# EAGLE design MIDI_CV_CONV (EAGLE 9.0.1)
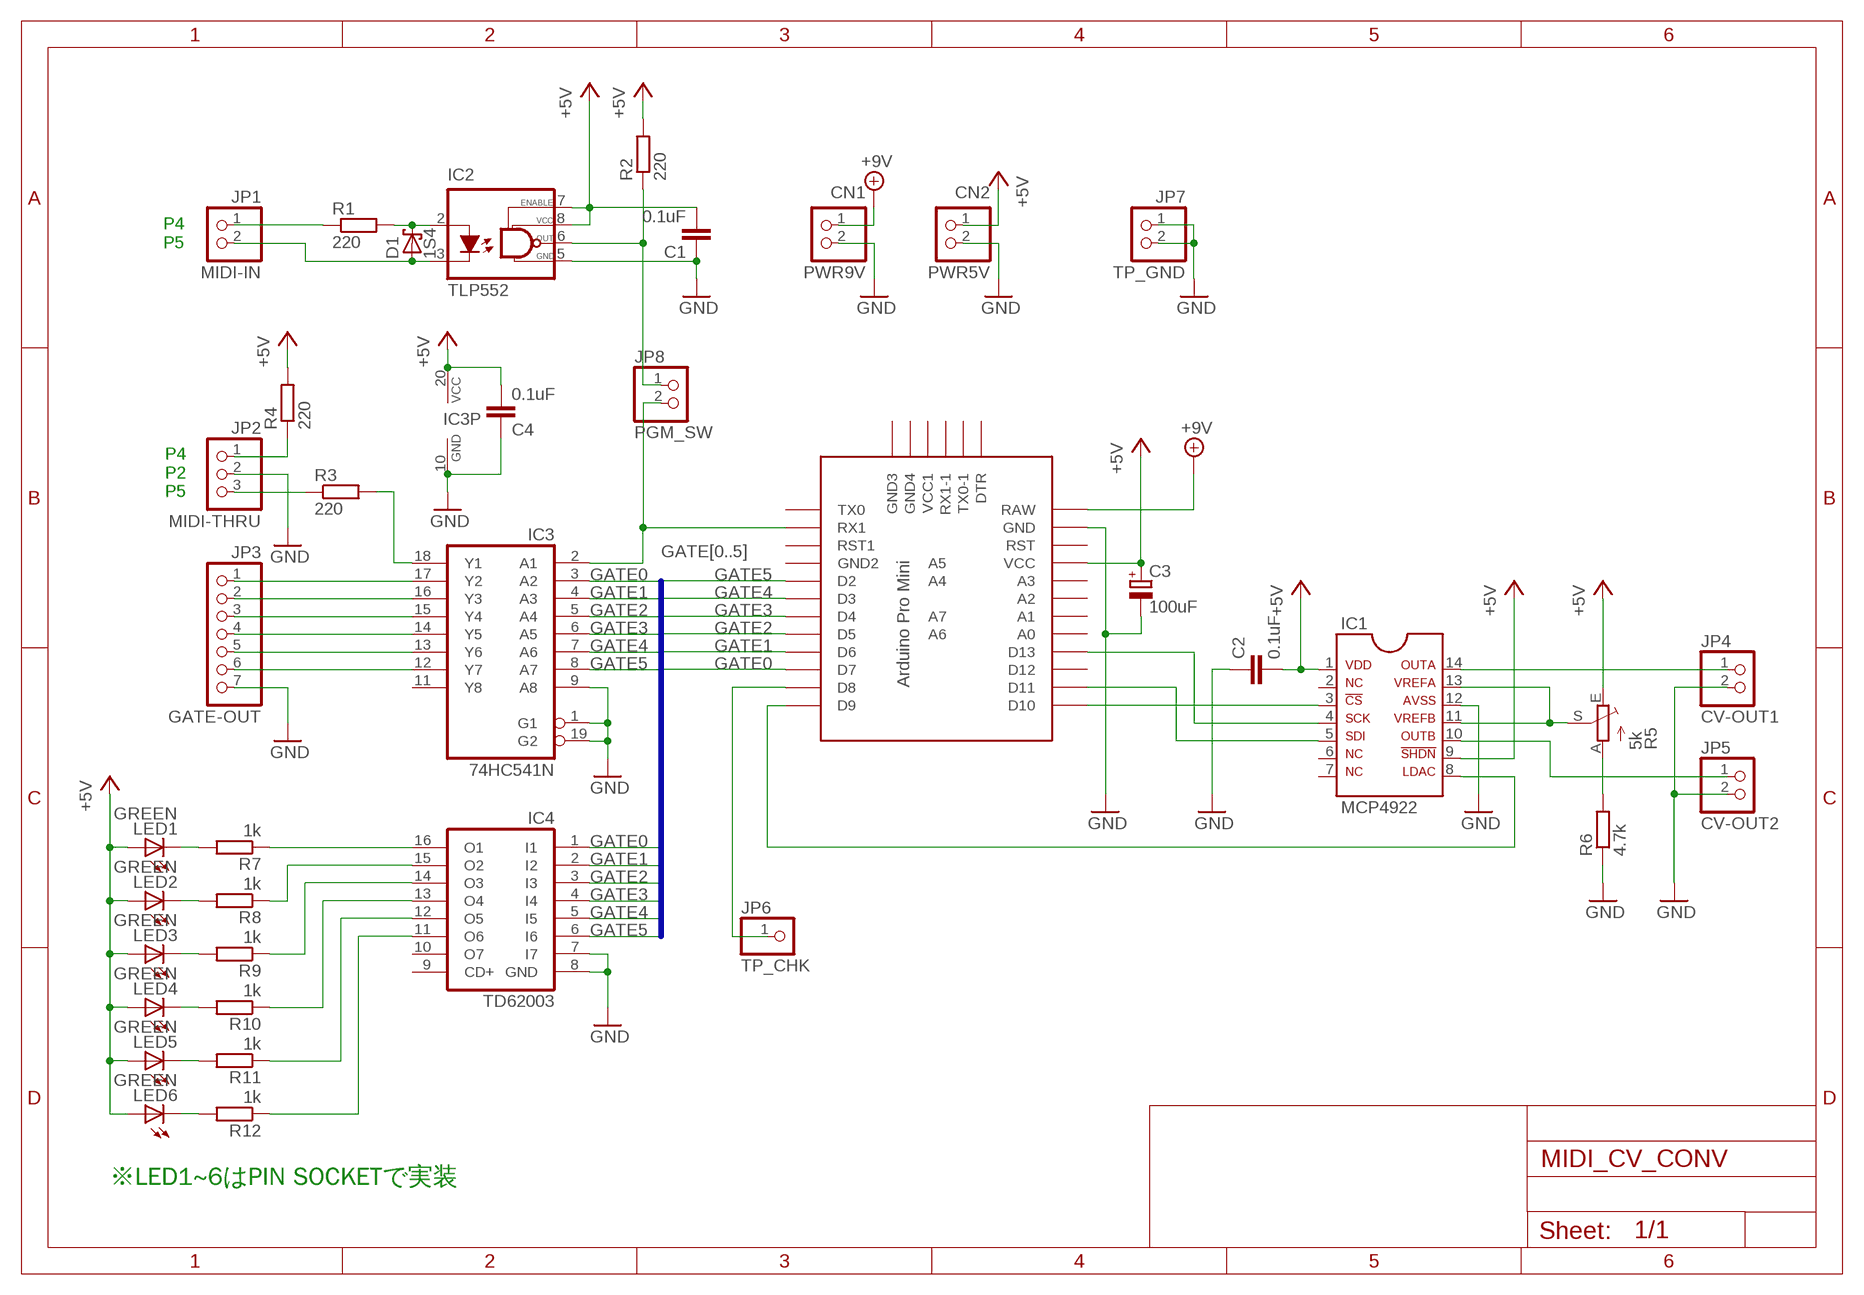
[diagram p0: schematic, sheet 1]

## Parts
C1  0.1uF  C-EU025-024X044  [C025-024X044]
C2  0.1uF  C-EU050-024X044  [C050-024X044]
C3  100uF  CPOL-EUE2.5-7  [E2,5-7]
C4  0.1uF  C-EU025-024X044  [C025-024X044]
CN1  PWR9V  B2B-XH-A  [B2B-XH-A]
CN2  PWR5V  B2B-XH-A  [B2B-XH-A]
D1  1S4  SCHOTTKY-DIODEDO35-7  [DO35-7]
IC1  MCP4922  [MCP4922]
IC2  TLP552  [DIL8]
IC3  74HC541N  [DIL20]
IC4  TD62003  ULN2001AN  [DIL16]
JP1  MIDI-IN  PINHD-1X2  [1X02]
JP2  MIDI-THRU  PINHD-1X3  [1X03]
JP3  GATE-OUT  PINHD-1X7  [1X07]
JP4  CV-OUT1  PINHD-1X2  [1X02]
JP5  CV-OUT2  PINHD-1X2  [1X02]
JP6  TP_CHK  PINHD-1X1  [1X01]
JP7  TP_GND  PINHD-1X2  [1X02]
JP8  PGM_SW  PINHD-1X2  [1X02]
LED1  GREEN  LED3MM  [LED3MM]
LED2  GREEN  LED3MM  [LED3MM]
LED3  GREEN  LED3MM  [LED3MM]
LED4  GREEN  LED3MM  [LED3MM]
LED5  GREEN  LED3MM  [LED3MM]
LED6  GREEN  LED3MM  [LED3MM]
R1  220  R-EU_0207/7  [0207/7]
R2  220  R-EU_0207/7  [0207/7]
R3  220  R-EU_0207/7  [0207/7]
R4  220  R-EU_0207/7  [0207/7]
R5  5k  TRIM_EU-CT6  [CT6]
R6  4.7k  R-EU_0207/7  [0207/7]
R7  1k  R-EU_0207/2V  [0207/2V]
R8  1k  R-EU_0207/2V  [0207/2V]
R9  1k  R-EU_0207/2V  [0207/2V]
R10  1k  R-EU_0207/2V  [0207/2V]
R11  1k  R-EU_0207/2V  [0207/2V]
R12  1k  R-EU_0207/2V  [0207/2V]
U$1  PRO-MINI-2 (16MHz/5V)  PRO-MINI-2  [PRO-MINI-2]

## Nets
+5V: C1.2 C2.2 C3.+ C4.2 CN2.1 IC1.1 IC1.9 IC2.7(EN) IC2.8(VCC) IC3.20(VCC) LED1.A LED2.A LED3.A LED4.A LED5.A LED6.A R2.2 R4.2 R5.E U$1.VCC
+9V: CN1.1 U$1.RAW
GATE0: IC3.3(A2) IC4.1(I1) U$1.D7
GATE1: IC3.4(A3) IC4.2(I2) U$1.D6
GATE2: IC3.5(A4) IC4.3(I3) U$1.D5
GATE3: IC3.6(A5) IC4.4(I4) U$1.D4
GATE4: IC3.7(A6) IC4.5(I5) U$1.D3
GATE5: IC3.8(A7) IC4.6(I6) U$1.D2
GND: C1.1 C2.1 C3.- C4.1 CN1.2 CN2.2 IC1.12 IC2.5(GND) IC3.1(G1) IC3.9(A8) IC3.10(GND) IC3.19(G2) IC4.7(I7) IC4.8(GND) JP2.2 JP3.7 JP4.2 JP5.2 JP7.1 JP7.2 R6.1 U$1.GND
N$1: D1.A IC2.3(C) JP1.2
N$2: IC3.2(A1) JP8.2 U$1.RX1
N$3: IC2.6(OUT) JP8.1 R2.1
N$4: D1.C IC2.2(A) R1.2
N$5: JP2.1 R4.1
N$6: JP2.3 R3.1
N$7: IC3.18(Y1) R3.2
N$8: IC3.17(Y2) JP3.1
N$9: IC3.16(Y3) JP3.2
N$10: IC3.15(Y4) JP3.3
N$11: IC3.14(Y5) JP3.4
N$12: IC3.13(Y6) JP3.5
N$13: IC3.12(Y7) JP3.6
N$14: IC1.3 U$1.D10
N$15: JP6.1 U$1.D8
N$16: LED1.K(C) R7.2
N$17: LED2.K(C) R8.2
N$18: LED3.K(C) R9.2
N$19: LED4.K(C) R10.2
N$20: LED5.K(C) R11.2
N$21: IC1.4 U$1.D13
N$22: IC1.5 U$1.D11
N$23: IC1.8 U$1.D9
N$24: R5.A R6.2
N$25: IC1.14 JP4.1
N$26: IC1.11 IC1.13 R5.S
N$27: IC1.10 JP5.1
N$28: LED6.K(C) R12.2
N$29: JP1.1 R1.1
N$30: IC4.16(O1) R7.1
N$37: IC4.15(O2) R8.1
N$38: IC4.14(O3) R9.1
N$39: IC4.13(O4) R10.1
N$40: IC4.12(O5) R11.1
N$41: IC4.11(O6) R12.1
Unconnected: IC1.2 IC1.6 IC1.7 IC3.11(Y8) IC4.9(CD+) IC4.10(O7) U$1.A0 U$1.A1 U$1.A2 U$1.A3 U$1.A4 U$1.A5 U$1.A6 U$1.A7 U$1.D12 U$1.DTR U$1.GND1(GND2) U$1.GND2(GND3) U$1.GND3(GND4) U$1.RST U$1.RST1 U$1.RX1-1 U$1.TX0 U$1.TX0-1 U$1.VCC1

## Buses
GATE[0..5]

## Notes on the sheet
- P4
  P5
- P4
  P2
  P5
- ※LED1~6はPIN SOCKETで実装

## Library data of the parts
C1 C2 C4 = rcl:C-EU: CAPACITOR, European symbol; SPICEPREFIX: C
C3 = rcl:CPOL-EU: POLARIZED CAPACITOR, European symbol; SPICEPREFIX: C
CN1 CN2 = jst-xh:B2B-XH-A: Wire-to-Board 2.5mm pitch top mount connector Source: http://www.jst-mfg.com/product/pdf/jpn/XH.pdf http://www.jst-mfg.com/product/detail.php?series=277
D1 = diode:SCHOTTKY-DIODE: Schottky Diode
IC1 = mylib2:MCP4922
IC2 = mylib2:TLP552
IC3 = 74xx-eu:74*541: Octal BUFFER and LINE DRIVER, 3-state
IC4 = uln-udn:ULN2001A: DRIVER ARRAY
JP1 JP4 JP5 JP7 JP8 = pinhead:PINHD-1X2: PIN HEADER
JP2 = pinhead:PINHD-1X3: PIN HEADER
JP3 = pinhead:PINHD-1X7: PIN HEADER
JP6 = pinhead:PINHD-1X1: PIN HEADER
LED1-LED6 = led:LED: LED OSRAM: - CHIPLED LG R971, LG N971, LY N971, LG Q971, LY Q971, LO R971, LY R971 LH N974, LH R974 LS Q976, LO Q976, LY Q976 LO Q996 - Hyper CHIPLED LW Q18S LB Q993, LB Q99A, LB R99A - SideLED LS A670, LO A670, LY A670, LG A670, LP A670 LB A673, LV A673, LT A673, LW A673 LH A674 LY A675 LS A676, LA A676, LO A676, LY A676, LW A676 LS A679, LY A679, LG A679 - Hyper Micro SIDELED® LS Y876, LA Y876, LO Y876, LY Y876 LT Y87S - SmartLED LW L88C, LW L88S LB L89C, LB L89S, LG L890 LS L89K, LO L89K, LY L89K LS L896, LA L896, LO L896, LY L896 - TOPLED LS T670, LO T670, LY T670, LG T670, LP T670 LSG T670, LSP T670, LSY T670, LOP T670, LYG T670 LG T671, LOG T671, LSG T671 LB T673, LV T673, LT T673, LW T673 LH T674 LS T676, LA T676, LO T676, LY T676, LB T676, LH T676, LSB T676, LW T676 LB T67C, LV T67C, LT T67C, LS T67K, LO T67K, LY T67K, LW E67C LS E67B, LA E67B, LO E67B, LY E67B, LB E67C, LV E67C, LT E67C LW T67C LS T679, LY T679, LG T679 LS T770, LO T770, LY T770, LG T770, LP T770 LB T773, LV T773, LT T773, LW T773 LH T774 LS E675, LA E675, LY E675, LS T675 LS T776, LA T776, LO T776, LY T776, LB T776 LHGB T686 LT T68C, LB T68C - Hyper Mini TOPLED® LB M676 - Mini TOPLED Santana® LG M470 LS M47K, LO M47K, LY M47K Source: http://www.osram.convergy.de LUXEON: - LUMILED® LXK2-PW12-R00, LXK2-PW12-S00, LXK2-PW14-U00, LXK2-PW14-V00 LXK2-PM12-R00, LXK2-PM12-S00, LXK2-PM14-U00 LXK2-PE12-Q00, LXK2-PE12-R00, LXK2-PE12-S00, LXK2-PE14-T00, LXK2-PE14-U00 LXK2-PB12-K00, LXK2-PB12-L00, LXK2-PB12-M00, LXK2-PB14-N00, LXK2-PB14-P00, LXK2-PB14-Q00 LXK2-PR12-L00, LXK2-PR12-M00, LXK2-PR14-Q00, LXK2-PR14-R00 LXK2-PD12-Q00, LXK2-PD12-R00, LXK2-PD12-S00 LXK2-PH12-R00, LXK2-PH12-S00 LXK2-PL12-P00, LXK2-PL12-Q00, LXK2-PL12-R00 Source: www.luxeon.com KINGBRIGHT: KA-3528ASYC Source: www.kingbright.com
R1-R4 R6-R12 = rcl:R-EU_: RESISTOR, European symbol; SPICEPREFIX: R
R5 = pot:TRIM_EU-: POTENTIOMETER
U$1 = Arduino-clone:PRO-MINI-2: Arduino Pro Mini Layout 2 Sparkfun.com

## Board
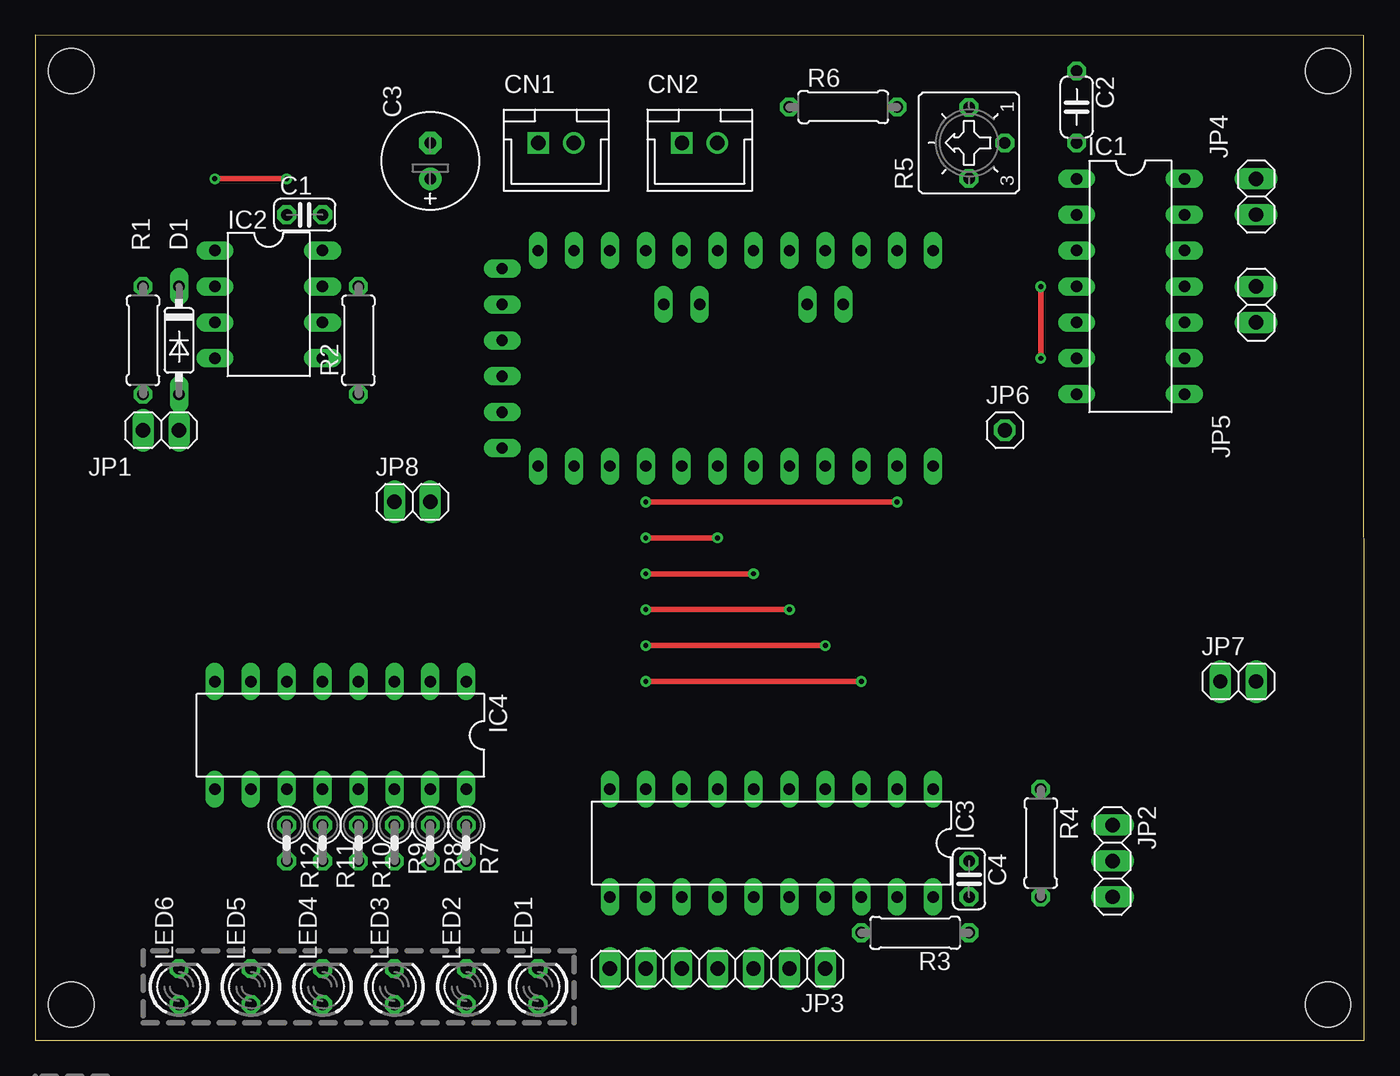
[diagram p1: board, top side]
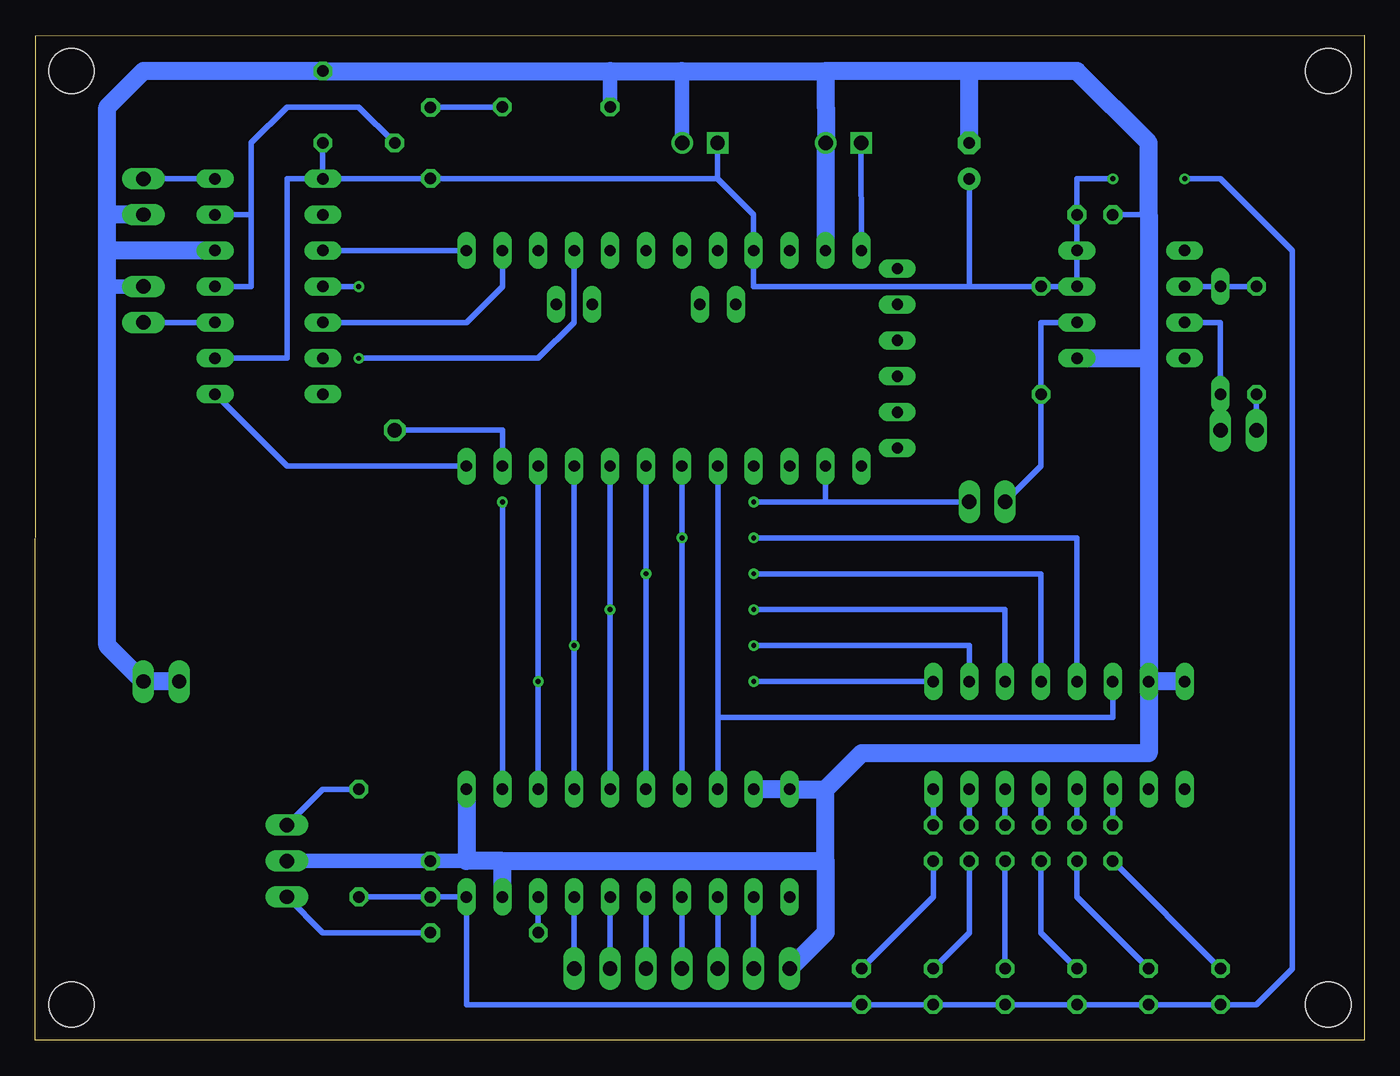
[diagram p2: board, bottom side, seen from below]

Size 94 x 71.11 mm. Coordinates in mm from the lower left corner, seen from the top.
Outline: 0,0 94,0.02 93.97,71.07 0,71.11 0,0
Copper layers (1*16): Top 0.035mm / dielectric 1.5mm / Bottom 0.035mm
Design rules "default": minimum track width 6mil, minimum drill 0.35mm, track to track 6mil, track to pad 6mil, pad to pad 6mil, via to via 6mil, smd to smd 6mil, copper to edge 40mil, drill to drill 6mil, minimum pad ring 10mil, minimum via ring 8mil, stop-mask expansion 4mil, vias tented up to drill 0mil, thermal gap 10mil
Holes 3.2 mm at 2.54,68.58 2.54,2.54 91.44,2.54 91.44,68.58

### Footprints (pad centres in the part's own frame; a part is rotated, then mirrored left to right if it is on the bottom)
C025-024X044 = drill 0.813 octagon: 1 -1.27,0; 2 1.27,0
C050-024X044 = drill 0.813 octagon: 1 -2.54,0; 2 2.54,0
E2,5-7 = drill 0.813 pad 1.6: + -1.27,0 | drill 0.813 pad 1.6 octagon: - 1.27,0
B2B-XH-A = drill 1.016 square: 1 -1.25,0 | drill 1.016: 2 1.25,0
DO35-7 = drill 0.813 long: A 3.81,0; C -3.81,0
MCP4922 = drill 0.813 long: 1 -6.35,-3.81; 2 -3.81,-3.81; 3 -1.27,-3.81; 4 1.27,-3.81; 5 3.81,-3.81; 6 6.35,-3.81; 7 8.89,-3.81; 8 8.89,3.81; 9 6.35,3.81; 10 3.81,3.81; 11 1.27,3.81; 12 -1.27,3.81; 13 -3.81,3.81; 14 -6.35,3.81
DIL8 = drill 0.813 long: 1 -3.81,-3.81; 2 -1.27,-3.81; 3 1.27,-3.81; 4 3.81,-3.81; 5 3.81,3.81; 6 1.27,3.81; 7 -1.27,3.81; 8 -3.81,3.81
DIL20 = drill 0.813 long: 1 -11.43,-3.81; 2 -8.89,-3.81; 3 -6.35,-3.81; 4 -3.81,-3.81; 5 -1.27,-3.81; 6 1.27,-3.81; 7 3.81,-3.81; 8 6.35,-3.81; 9 8.89,-3.81; 10 11.43,-3.81; 11 11.43,3.81; 12 8.89,3.81; 13 6.35,3.81; 14 3.81,3.81; 15 1.27,3.81; 16 -1.27,3.81; 17 -3.81,3.81; 18 -6.35,3.81; 19 -8.89,3.81; 20 -11.43,3.81
DIL16 = drill 0.813 long: 1 -8.89,-3.81; 2 -6.35,-3.81; 3 -3.81,-3.81; 4 -1.27,-3.81; 5 1.27,-3.81; 6 3.81,-3.81; 7 6.35,-3.81; 8 8.89,-3.81; 9 8.89,3.81; 10 6.35,3.81; 11 3.81,3.81; 12 1.27,3.81; 13 -1.27,3.81; 14 -3.81,3.81; 15 -6.35,3.81; 16 -8.89,3.81
1X02 = drill 1.016 long: 1 -1.27,0; 2 1.27,0
1X03 = drill 1.016 long: 1 -2.54,0; 2 0,0; 3 2.54,0
1X07 = drill 1.016 long: 1 -7.62,0; 2 -5.08,0; 3 -2.54,0; 4 0,0; 5 2.54,0; 6 5.08,0; 7 7.62,0
1X01 = drill 1.016 octagon: 1 0,0
LED3MM = drill 0.813 octagon: A -1.27,0; K 1.27,0
0207/7 = drill 0.813 octagon: 1 -3.81,0; 2 3.81,0
CT6 = drill 0.813 octagon: A 2.515,0; E -2.515,0; S 0,-2.54
0207/2V = drill 0.813 octagon: 1 -1.27,0; 2 1.27,0
PRO-MINI-2 = drill 0.8 long: A0 6.35,2.54; A1 6.35,0; A2 6.35,-2.54; A3 6.35,-5.08; A4 2.54,1.27; A5 2.54,3.81; A6 2.54,-8.89; A7 2.54,-6.35; D2 -8.89,2.54; D3 -8.89,0; D4 -8.89,-2.54; D5 -8.89,-5.08; D6 -8.89,-7.62; D7 -8.89,-10.16; D8 -8.89,-12.7; D9 -8.89,-15.24; D10 6.35,-15.24; D11 6.35,-12.7; D12 6.35,-10.16; D13 6.35,-7.62; DTR 5.08,15.24; GND 6.35,10.16; GND1 -8.89,5.08; GND2 -7.62,15.24; GND3 -5.08,15.24; RAW 6.35,12.7; RST 6.35,7.62; RST1 -8.89,7.62; RX1 -8.89,10.16; RX1-1 0,15.24; TX0 -8.89,12.7; TX0-1 2.54,15.24; VCC 6.35,5.08; VCC1 -2.54,15.24

### Placement (x,y rotation side)
C1  19.05,58.42 0 top
C2  73.66,66.04 270 top
C3  27.94,62.23 90 top
C4  66.04,11.43 270 top
CN1  36.83,63.5 0 top
CN2  46.99,63.5 0 top
D1  10.16,49.53 270 top
IC1  77.47,54.61 270 top
IC2  16.51,52.07 270 top
IC3  52.07,13.97 180 top
IC4  21.59,21.59 180 top
JP1  8.89,43.18 0 top
JP2  76.2,12.7 270 top
JP3  48.26,5.08 180 top
JP4  86.36,59.69 270 top
JP5  86.36,52.07 90 top
JP6  68.58,43.18 0 top
JP7  85.09,25.4 0 top
JP8  26.67,38.1 0 top
LED1  35.56,3.81 90 top
LED2  30.48,3.81 90 top
LED3  25.4,3.81 90 top
LED4  20.32,3.81 90 top
LED5  15.24,3.81 90 top
LED6  10.16,3.81 90 top
R1  7.62,49.53 90 top
R2  22.86,49.53 90 top
R3  62.23,7.62 180 top
R4  71.12,13.97 270 top
R5  66.04,63.5 90 top
R6  57.15,66.04 0 top
R7  30.48,13.97 270 top
R8  27.94,13.97 270 top
R9  25.4,13.97 270 top
R10  22.86,13.97 270 top
R11  20.32,13.97 270 top
R12  17.78,13.97 270 top
U$1  48.26,49.53 90 top

### Tracks (layer width: path | path; a pad name or v marks a point on that pad's centre or on a via)
+5V  (via drill 0.35)
  Top 0.406: v12.7,60.96 v17.78,60.96
  Bottom 0.406: 27.94,53.34 R2.2 IC2.7 IC2.8 C1.2 20.32,60.96 v17.78,60.96 | 27.94,53.34 43.18,53.34 U$1.VCC 43.18,58.42 45.74,60.98 | C2.2 IC1.1 | IC1.9 76.2,48.26 76.2,60.96 IC1.1 | 45.74,60.98 R5.E 66.06,60.96 IC1.1 | R4.2 C4.2 IC3.20 63.5,2.54 LED1.A LED2.A LED3.A LED4.A LED5.A LED6.A 7.62,2.54 5.08,5.08 5.08,55.88 10.16,60.96 v12.7,60.96 | C3.+ 27.94,53.34 | CN2.1 45.74,60.99 45.74,60.98
+9V
  Bottom 0.406: CN1.1 U$1.RAW
GATE0  (via drill 0.35)
  Top 0.406: v43.18,25.4 v58.42,25.4
  Bottom 0.406: U$1.D7 v58.42,25.4 IC3.3 | IC4.1 v43.18,25.4
GATE1  (via drill 0.35)
  Top 0.406: v43.18,27.94 v55.88,27.94
  Bottom 0.406: IC4.2 27.94,27.94 v43.18,27.94 | U$1.D6 v55.88,27.94 IC3.4
GATE2  (via drill 0.35)
  Top 0.406: v43.18,30.48 v53.34,30.48
  Bottom 0.406: IC4.3 25.4,30.48 v43.18,30.48 | U$1.D5 v53.34,30.48 IC3.5
GATE3  (via drill 0.35)
  Top 0.406: v43.18,33.02 v50.8,33.02
  Bottom 0.406: U$1.D4 v50.8,33.02 IC3.6 | IC4.4 22.86,33.02 v43.18,33.02
GATE4  (via drill 0.35)
  Top 0.406: v43.18,35.56 v48.26,35.56
  Bottom 0.406: IC4.5 20.32,35.56 v43.18,35.56 | U$1.D3 v48.26,35.56 IC3.7
GATE5
  Bottom 0.406: U$1.D2 45.72,22.86 | 45.72,22.86 IC3.8 | IC4.6 17.78,22.86 45.72,22.86
GND
  Bottom 0.406: CN1.2 38.08,66.04 38.1,66.04 | C1.1 15.24,58.42
  Bottom 1.016: JP5.2 88.9,53.34 | R6.1 53.34,68.58 | 63.5,12.7 C4.1 JP2.2 | CN2.2 48.24,68.56 48.26,68.58
  Bottom 1.27: IC3.19 60.96,12.7 | 60.96,12.7 63.5,12.7 IC3.1 | 60.96,12.7 38.1,12.7 | IC3.9 IC3.10 38.1,17.78 | 38.1,12.7 38.1,7.62 JP3.7 | IC4.8 IC4.7 | IC4.7 15.24,20.32 35.56,20.32 38.1,17.78 | 38.08,66.04 38.09,60.96 U$1.GND | 27.94,68.58 20.32,68.58 15.24,63.5 15.24,58.42 15.24,48.26 | 27.94,68.58 38.1,68.58 | 38.1,68.58 38.1,66.04 | 15.24,48.26 IC4.7 | IC2.5 15.24,48.26 | JP4.2 88.9,58.42 | 88.9,58.42 88.9,66.04 86.36,68.58 C2.1 53.34,68.58 48.26,68.58 38.1,68.58 | 88.9,55.88 88.9,53.34 88.9,27.94 JP7.2 JP7.1 | 88.9,55.88 88.9,58.42 | IC1.12 88.9,55.88 | C3.- 27.94,68.58 | 38.1,12.7 38.1,17.78
N$1
  Bottom 0.406: IC2.3 10.16,50.8 D1.A JP1.2
N$2  (via drill 0.35)
  Top 0.406: v60.96,38.1 v43.18,38.1
  Bottom 0.406: IC3.2 v60.96,38.1 | v43.18,38.1 38.1,38.1 | 38.1,38.1 U$1.RX1 | JP8.2 38.1,38.1
N$3
  Bottom 0.406: IC2.6 22.86,50.8 R2.1 22.86,40.64 JP8.1
N$4
  Bottom 0.406: R1.2 D1.C IC2.2
N$5
  Bottom 0.406: R4.1 73.66,17.78 JP2.1
N$6
  Bottom 0.406: R3.1 73.66,7.62 JP2.3
N$7
  Bottom 0.406: IC3.18 R3.2
N$8
  Bottom 0.406: IC3.17 JP3.1
N$9
  Bottom 0.406: IC3.16 JP3.2
N$10
  Bottom 0.406: IC3.15 JP3.3
N$11
  Bottom 0.406: IC3.14 JP3.4
N$12
  Bottom 0.406: IC3.13 JP3.5
N$13
  Bottom 0.406: IC3.12 JP3.6
N$14
  Bottom 0.406: U$1.D10 IC1.3
N$15
  Bottom 0.406: U$1.D8 60.96,43.18 JP6.1
N$16
  Bottom 0.406: R7.2 30.48,10.16 LED1.K
N$17
  Bottom 0.406: R8.2 27.94,7.62 LED2.K
N$18
  Bottom 0.406: LED3.K R9.2
N$19
  Bottom 0.406: LED4.K 22.86,7.62 R10.2
N$20
  Bottom 0.406: R11.2 20.32,10.16 LED5.K
N$21  (via drill 0.35)
  Top 0.406: v71.12,48.26 v71.12,53.34
  Bottom 0.406: U$1.D13 55.88,50.8 58.42,48.26 v71.12,48.26 | v71.12,53.34 IC1.4
N$22
  Bottom 0.406: U$1.D11 60.96,53.34 63.5,50.8 IC1.5
N$23
  Bottom 0.406: U$1.D9 76.2,40.64 IC1.8
N$24
  Bottom 0.406: R5.A 60.98,66.02 R6.2
N$25
  Bottom 0.406: IC1.14 JP4.1
N$26
  Bottom 0.406: IC1.11 78.74,53.34 78.74,58.42 | 78.74,58.42 IC1.13 | 78.74,58.42 78.74,63.5 76.2,66.04 71.12,66.04 R5.S
N$27
  Bottom 0.406: IC1.10 JP5.1
N$28
  Bottom 0.406: R12.2 LED6.K
N$29
  Bottom 0.406: JP1.1 R1.1
N$30
  Bottom 0.406: IC4.16 R7.1
N$37
  Bottom 0.406: IC4.15 R8.1
N$38
  Bottom 0.406: IC4.14 R9.1
N$39
  Bottom 0.406: IC4.13 R10.1
N$40
  Bottom 0.406: IC4.12 R11.1
N$41
  Bottom 0.406: IC4.11 R12.1

### Text on the board
tDocu: MIDI_CV_CONV | http://dad8893.blogspot.com/ | はPinSocketで実装